# EasyEDA schematic 1-Schematic_Sprinkler.json
TITLE: SPRINKLER; REV: 1.1; Date: 2018-08-20; Sheet: 1/1; Drawn By: Damien DEOM
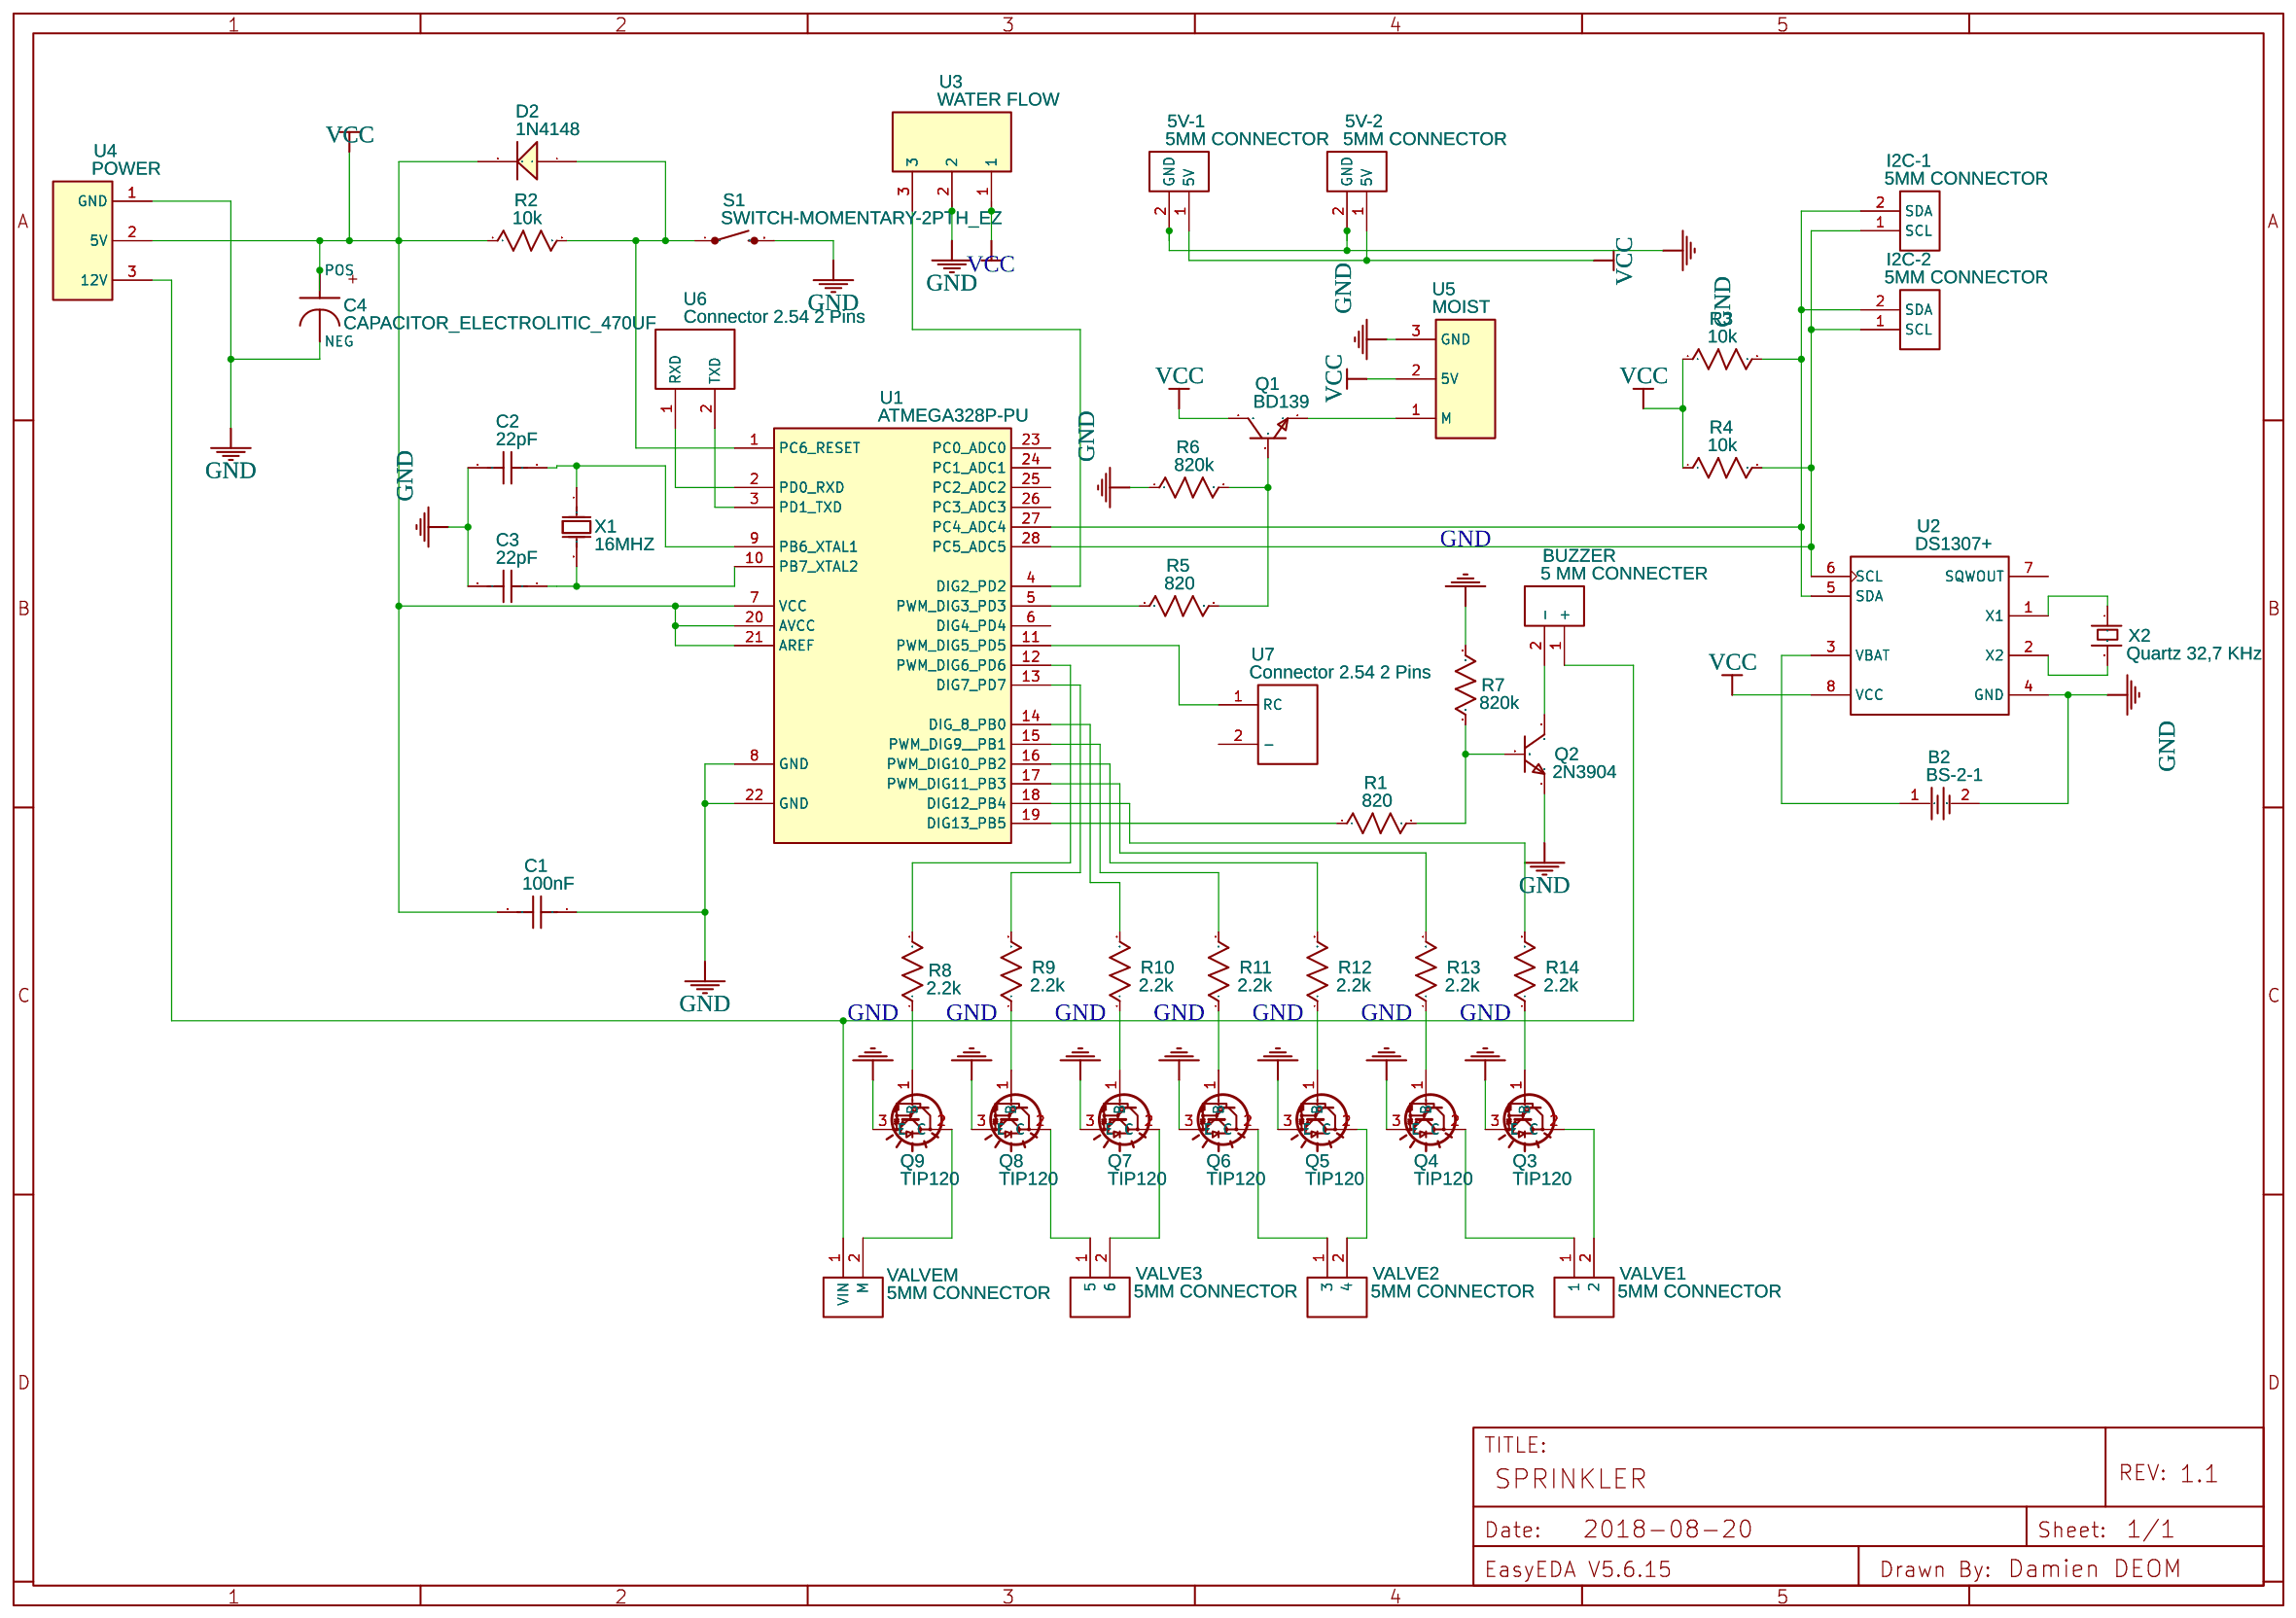
[diagram p0: schematic sheet]

## Parts
5V-1  5MM CONNECTOR  [5MM CONNECTOR]
5V-2  5MM CONNECTOR  [5MM CONNECTOR]
B2  BS-2-1  [BATTERY-1]
BUZZER  5 MM CONNECTER  [5MM CONNECTOR]
C1  100nF  [RAD-0.1]
C2  22pF  [RAD-0.1]
C3  22pF  [RAD-0.1]
C4  CAPACITOR_ELECTROLITIC_470UF  [CAPACITOR_ZLH_10X12.5]
D2  1N4148  [DO-35]
I2C-1  5MM CONNECTOR  [5MM CONNECTOR]
I2C-2  5MM CONNECTOR  [5MM CONNECTOR]
Q1  BD139  [TO-126]
Q2  2N3904  [TO-92(TO-92-3)]
Q3  TIP120  [TO-220_VERTICAL]
Q4  TIP120  [TO-220_VERTICAL]
Q5  TIP120  [TO-220_VERTICAL]
Q6  TIP120  [TO-220_VERTICAL]
Q7  TIP120  [TO-220_VERTICAL]
Q8  TIP120  [TO-220_VERTICAL]
Q9  TIP120  [TO-220_VERTICAL]
R1  820  [AXIAL-0.3]
R2  10k  [AXIAL-0.3]
R3  10k  [AXIAL-0.3]
R4  10k  [AXIAL-0.3]
R5  820  [AXIAL-0.3]
R6  820k  [AXIAL-0.3]
R7  820k  [AXIAL-0.3]
R8  2.2k  [AXIAL-0.3]
R9  2.2k  [AXIAL-0.3]
R10  2.2k  [AXIAL-0.3]
R11  2.2k  [AXIAL-0.3]
R12  2.2k  [AXIAL-0.3]
R13  2.2k  [AXIAL-0.3]
R14  2.2k  [AXIAL-0.3]
S1  SWITCH-MOMENTARY-2PTH_EZ  [TACTILE-PTH-EZ]
U1  ATMEGA328P-PU  [DIP-28_300MIL]
U2  DS1307+  [DIP-8]
U3  WATER FLOW  [CONNECTOR 3P 5MM_2]
U4  POWER  [CONNECTOR 3P 5MM_2]
U5  MOIST  [CONNECTOR 3P 5MM_2]
U6  Connector 2.54 2 Pins  [CONNECTOR 2.54 2 PINS]
U7  Connector 2.54 2 Pins  [CONNECTOR 2.54 2 PINS]
VALVE1  5MM CONNECTOR  [5MM CONNECTOR]
VALVE2  5MM CONNECTOR  [5MM CONNECTOR]
VALVE3  5MM CONNECTOR  [5MM CONNECTOR]
VALVEM  5MM CONNECTOR  [5MM CONNECTOR]
X1  16MHZ  [OSC-49S-1]
X2  Quartz 32,7 KHz  [XTAL1X2]

## Library data of the parts
5V-1 5V-2 BUZZER I2C-1 I2C-2 VALVE1-VALVE3 VALVEM = -: Contributor: mamdouh.azmy
B2 = -: Supplier: LCSC; Manufacturer: Q&J; image: //image.lceda.cn/szlcsc/C70376.jpg; Contributor: LCSC; Supplier Part: C70376
C1-C3 = Cap_RAD-0.1_US: Manufacturer Part: ?
C4 = -: Contributor: ttgraham; Manufacturer Part: ?
D2 = -: High Conductance Fast Diode; Manufacturer Part: ?
Q1 = -: Supplier: LCSC; Manufacturer: STMicroelectronics; image: //image.lceda.cn/szlcsc/C27866.jpg; Contributor: LCSC; Supplier Part: C27866
Q2 = -: Supplier Part: C118538; Supplier: LCSC; Manufacturer: SEMTECH
Q3-Q9 = -: Contributor: KiCAD; license: https://www.gnu.org/licenses/lgpl-2.1.html; Manufacturer Part: ?
R1-R14 = Res_AXIAL-0.3(1/8W)_US: Manufacturer Part: ?
S1 = -: Various NO switches- pushbuttons, reed, etc; Contributor: SparkFun; Manufacturer Part: ?
U1 = -: sourceId: Oic6oiASL; Supplier: LCSC; Manufacturer: MICROCHIP; image: //image.lceda.cn/szlcsc/C33901.jpg; Contributor: LCSC; Supplier Part: C33901
U2 = -: Supplier: LCSC; Manufacturer: MAXIM; Contributor: LCSC; Supplier Part: C59267
U3-U5 = -: Manufacturer Part: New SchematicLib; Contributor: alberto1966
U6 U7 = -: Manufacturer Part: New SchematicLib; Contributor: ymahinc
X1 = -: Supplier: EasyEDA; Manufacturer: EasyEDA; Manufacturer Part: X49SD16MSD2SC; Supplier Part: C16212
X2 = -: Contributor: craindowl; sourceId: K5BhbtnFX; Manufacturer Part: ?

## Nets
GND: 5V-1.2(GND) 5V-2.2(GND) B2.2 C1.1 C2.2 C3.2 C4.NEG Q2.1(E) Q3.3(E) Q4.3(E) Q5.3(E) Q6.3(E) Q7.3(E) Q8.3(E) Q9.3(E) R6.1 R7.2 S1.3(2) U1.8(GND) U1.22(GND) U2.4(GND) U3.2 U4.1(GND) U5.3(GND)
VCC: 5V-1.1(5V) 5V-2.1(5V) C1.2 C4.POS D2.2(K) Q1.2(C) R2.1 R3.1 R4.1 U1.7(VCC) U1.20(AVCC) U1.21(AREF) U2.8(VCC) U3.1 U4.2(5V) U5.2(5V)
Q1_1: Q1.1(B) R5.2 R6.2
Q1_3: Q1.3(E) U5.1(M)
Q2_3: BUZZER.2(-) Q2.3(C)
Q3_1: Q3.1(B) R14.1
Q3_2: Q3.2(C) VALVE1.2
Q4_1: Q4.1(B) R13.1
Q4_2: Q4.2(C) VALVE1.1
Q5_1: Q5.1(B) R12.1
Q5_2: Q5.2(C) VALVE2.2(4)
Q6_1: Q6.1(B) R11.1
Q6_2: Q6.2(C) VALVE2.1(3)
Q7_1: Q7.1(B) R10.1
Q7_2: Q7.2(C) VALVE3.2(6)
Q8_1: Q8.1(B) R9.1
Q8_2: Q8.2(C) VALVE3.1(5)
Q9_1: Q9.1(B) R8.1
Q9_2: Q9.2(C) VALVEM.2(M)
R1_2: Q2.2(B) R1.2 R7.1
U1_1: D2.1(A) R2.2 S1.1 U1.1(PC6 RESET)
U1_2: U1.2(PD0 RXD) U6.1(RXD)
U1_3: U1.3(PD1 TXD) U6.2(TXD)
U1_4: U1.4(DIG2 PD2) U3.3
U1_5: R5.1 U1.5(PWM DIG3 PD3)
U1_9: C2.1 U1.9(PB6 XTAL1) X1.1(OSC1)
U1_10: C3.1 U1.10(PB7 XTAL2) X1.2(OSC2)
U1_11: U1.11(PWM DIG5 PD5) U7.1(RC)
U1_12: R8.2 U1.12(PWM DIG6 PD6)
U1_13: R9.2 U1.13(DIG7 PD7)
U1_14: R10.2 U1.14(DIG 8 PB0)
U1_15: R11.2 U1.15(PWM DIG9  PB1)
U1_16: R12.2 U1.16(PWM DIG10 PB2)
U1_17: R13.2 U1.17(PWM DIG11 PB3)
U1_18: R14.2 U1.18(DIG12 PB4)
U1_19: R1.1 U1.19(DIG13 PB5)
U1_27: I2C-1.2(SDA) I2C-2.2(SDA) R3.2 U1.27(PC4 ADC4) U2.5(SDA)
U1_28: I2C-1.1(SCL) I2C-2.1(SCL) R4.2 U1.28(PC5 ADC5) U2.6(SCL)
U2_1: U2.1(X1) X2.1
U2_2: U2.2(X2) X2.2
U2_3: B2.1 U2.3(VBAT)
VALVEM_1: BUZZER.1(+) U4.3(12V) VALVEM.1(VIN)

Not connected (* = marked no-connect by the designer): U1 6(DIG4 PD4) 23(PC0 ADC0) 24(PC1 ADC1) 25(PC2 ADC2) 26(PC3 ADC3); U2 7(SQWOUT); U7 2(-)
